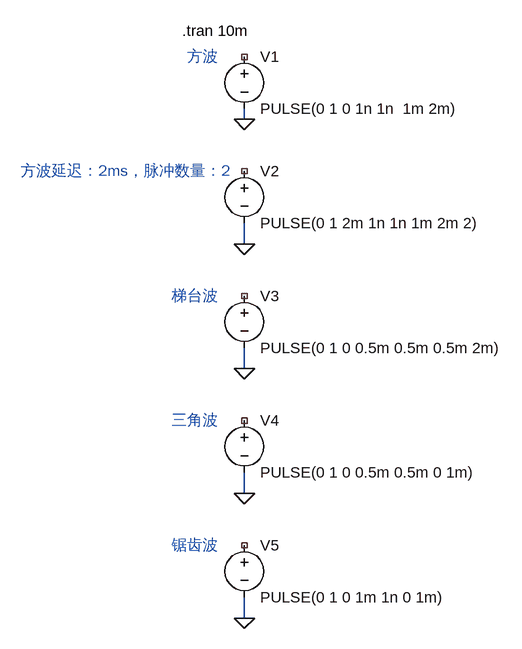
[diagram p0: schematic 05_ShapedWave.asc]
05_ShapedWave.asc, the LTspice schematic file:
Version 4
SHEET 1 880 1008
WIRE -176 224 -176 208
WIRE -176 416 -176 384
WIRE -176 608 -176 576
WIRE -176 800 -176 768
WIRE -176 992 -176 960
FLAG -176 224 0
FLAG -176 416 0
FLAG -176 608 0
FLAG -176 800 0
FLAG -176 992 0
SYMBOL Voltage -176 112 R0
SYMATTR InstName V1
SYMATTR Value PULSE(0 1 0 1n 1n  1m 2m)
SYMBOL Voltage -176 288 R0
SYMATTR InstName V2
SYMATTR Value PULSE(0 1 2m 1n 1n 1m 2m 2)
SYMBOL Voltage -176 480 R0
SYMATTR InstName V3
SYMATTR Value PULSE(0 1 0 0.5m 0.5m 0.5m 2m)
SYMBOL Voltage -176 672 R0
SYMATTR InstName V4
SYMATTR Value PULSE(0 1 0 0.5m 0.5m 0 1m)
SYMBOL Voltage -176 864 R0
SYMATTR InstName V5
SYMATTR Value PULSE(0 1 0 1m 1n 0 1m)
TEXT -264 128 Left 2 ;方波
TEXT -272 88 Left 2 !.tran 10m
TEXT -520 304 Left 2 ;方波延迟：2ms，脉冲数量：2
TEXT -288 496 Left 2 ;梯台波
TEXT -288 688 Left 2 ;三角波
TEXT -288 880 Left 2 ;锯齿波

The netlist it stands for:
* 05_ShapedWave.asc
V1 NC_01 0 PULSE(0 1 0 1n 1n  1m 2m)
V2 NC_02 0 PULSE(0 1 2m 1n 1n 1m 2m 2)
V3 NC_03 0 PULSE(0 1 0 0.5m 0.5m 0.5m 2m)
V4 NC_04 0 PULSE(0 1 0 0.5m 0.5m 0 1m)
V5 NC_05 0 PULSE(0 1 0 1m 1n 0 1m)
* 方波
.tran 10m
* 方波延迟：2ms，脉冲数量：2
* 梯台波
* 三角波
* 锯齿波
.backanno
.end